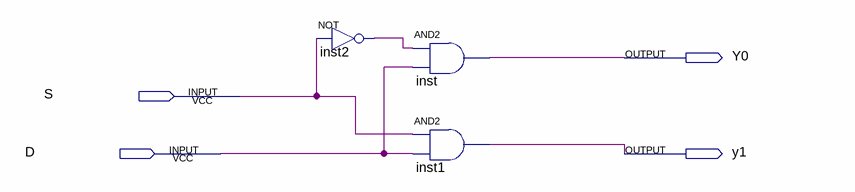
[diagram p0: schematic sheet]
// Quartus schematic 12dmux.bdf as structural Verilog: 3 symbols, 4 pins
module \12dmux  (
  input  S,
  input  D,
  output Y0,
  output y1
);

  wire inst2_out;

  not inst2 (inst2_out, S);
  and inst (Y0, inst2_out, D);
  and inst1 (y1, S, D);
endmodule
